# EAGLE design Sensirion_connector_board_v002 (EAGLE 9.6.2)
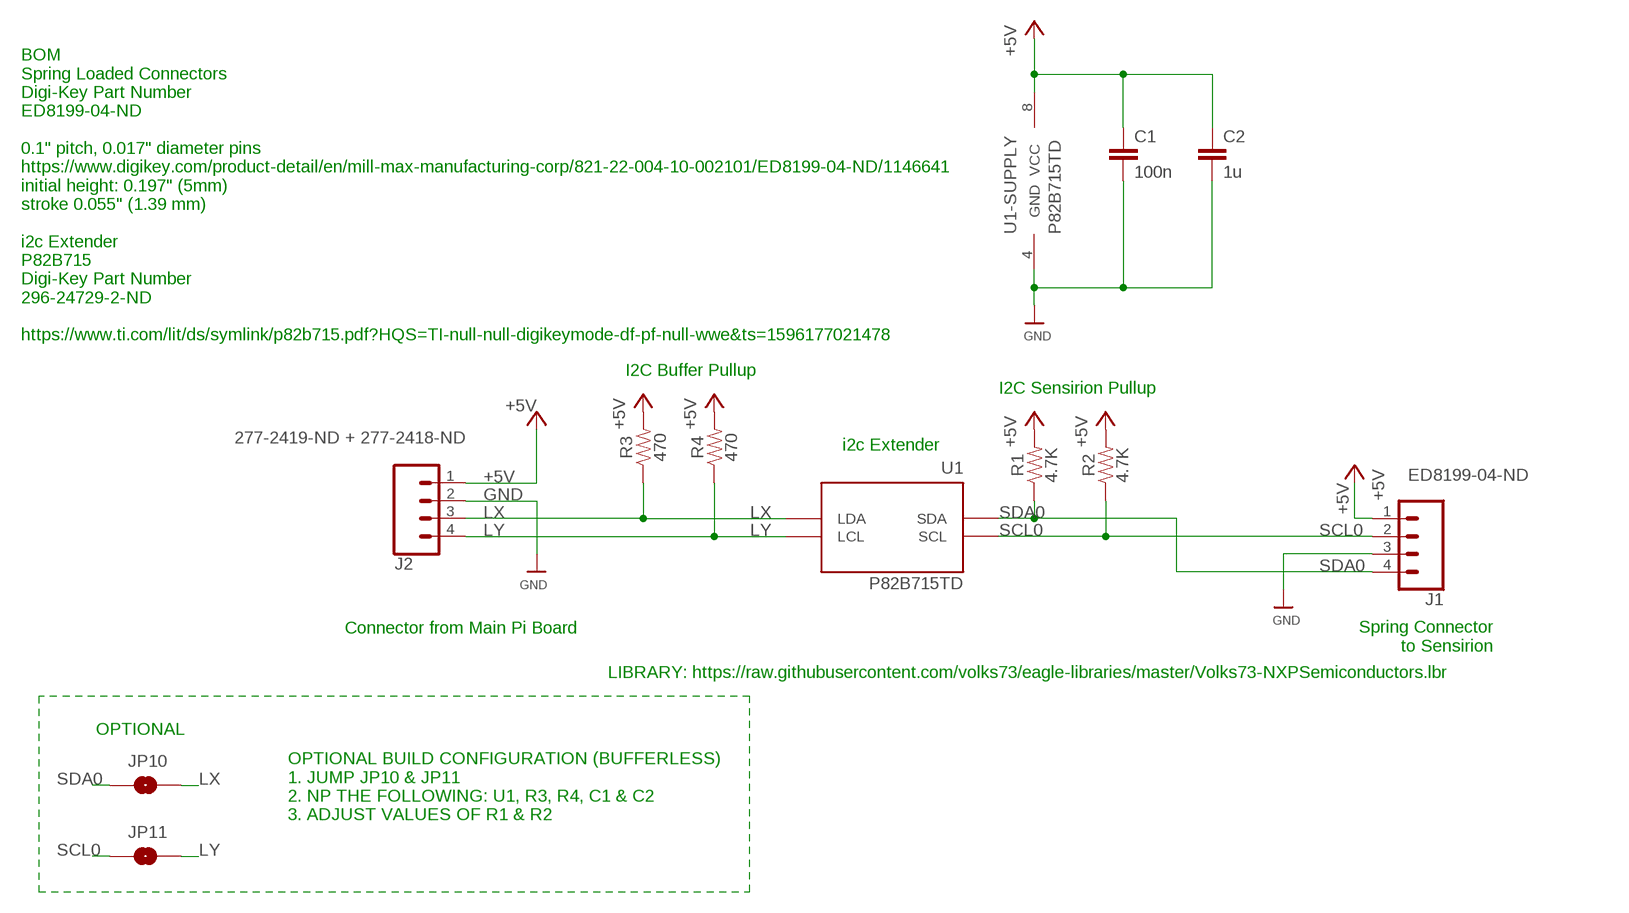
[diagram p0: schematic, sheet 1]

## Parts
C1  100n  CAP-0805  [0805]
C2  1u  CAP-0805  [0805]
J1  ED8199-04-ND  CONN_0430MILL_DIA  [1X04_30MILL_DIA]
J2  277-2419-ND + 277-2418-ND  CONN_043.5MM_RA  [1X04_3.5MM_RA]
JP10  JUMPER-SMT_2_NO_SILK  [SMT-JUMPER_2_NO_SILK]
JP11  JUMPER-SMT_2_NO_SILK  [SMT-JUMPER_2_NO_SILK]
R1  4.7K  0.3OHM-0805-1/8W-1%  [0805]
R2  4.7K  0.3OHM-0805-1/8W-1%  [0805]
R3  470  0.3OHM-0805-1/8W-1%  [0805]
R4  470  0.3OHM-0805-1/8W-1%  [0805]
U1  P82B715TD  [SOIC-8]

## Nets
+5V: C1.1 C2.1 J1.1 J2.1 R1.2 R2.2 R3.2 R4.2 U1.8(VCC)
GND: C1.2 C2.2 J1.3 J2.2 U1.4(GND)
LX: J2.3 JP10.2 R3.1 U1.7(LDA)
LY: J2.4 JP11.2 R4.1 U1.2(LCL)
SCL0: J1.2 JP11.1 R2.1 U1.3(SCL)
SDA0: J1.4 JP10.1 R1.1 U1.6(SDA)

## Notes on the sheet
- BOM
  Spring Loaded Connectors 
  Digi-Key Part Number
  ED8199-04-ND
  
  0.1" pitch, 0.017" diameter pins
  https://www.digikey.com/product-detail/en/mill-max-manufacturing-corp/821-22-004-10-002101/ED8199-04-ND/1146641
  initial height: 0.197" (5mm)
  stroke 0.055" (1.39 mm)
  
  i2c Extender
  P82B715 
  Digi-Key Part Number
  296-24729-2-ND
  
  https://www.ti.com/lit/ds/symlink/p82b715.pdf?HQS=TI-null-null-digikeymode-df-pf-null-wwe&ts=1596177021478
- I2C Buffer Pullup
- I2C Sensirion Pullup
- i2c Extender
- Connector from Main Pi Board
- Spring Connector
  to Sensirion
- LIBRARY: https://raw.githubusercontent.com/volks73/eagle-libraries/master/Volks73-NXPSemiconductors.lbr
- OPTIONAL
- OPTIONAL BUILD CONFIGURATION (BUFFERLESS)
  1. JUMP JP10 & JP11
  2. NP THE FOLLOWING: U1, R3, R4, C1 & C2
  3. ADJUST VALUES OF R1 & R2

## Library data of the parts
C1 C2 = SparkFun-Capacitors:CAP
J1 J2 = th_libraries:CONN_04: Multi connection point. Often used as Generic Header-pin footprint for 0.1 inch spaced/style header connections On any of the 0.1 inch spaced packages, you can populate with these: Break Away Headers - Straight <https://www.sparkfun.com/products/116> (PRT-00116) Break Away Male Headers - Right Angle <https://www.sparkfun.com/products/553> (PRT-00553) Female Headers <https://www.sparkfun.com/products/115> (PRT-00115) Break Away Headers - Machine Pin <https://www.sparkfun.com/products/117> (PRT-00117) Break Away Female Headers - Swiss Machine Pin <https://www.sparkfun.com/products/743> (PRT-00743) For SCREWTERMINALS and SPRING TERMINALS visit here: Screw Terimnals on SparkFun.com <https://www.sparkfun.com/search/results?term=Screw+Terminals> (5mm/3.5mm/2.54mm spacing) This device is also useful as a general connection point to wire up your design to another part of your project. Our various solder wires solder well into these plated through hole pads. Hook-Up Wire - Assortment (Stranded, 22 AWG) <https://www.sparkfun.com/products/11375> (PRT-11375) Hook-Up Wire - Assortment (Solid Core, 22 AWG) <https://www.sparkfun.com/products/11367> (PRT-11367) View the entire wire category on our website here <https://www.sparkfun.com/categories/141> Special notes: Molex polarized connector foot print use with SKU : PRT-08231 with associated crimp pins and housings. 1MM SMD Version SKU: PRT-10208
JP10 JP11 = SparkFun-Jumpers:JUMPER-SMT_2_NO: Normally open jumper This jumper has two pads in close proximity to each other. Apply solder to close the connection. Round pads are easier to solder for beginners, but are a lot larger. SparkFun Product that uses the round pads: SparkFun EL Sequencer <https://www.sparkfun.com/products/12781>
R1-R4 = SparkFun-Resistors:0.3OHM: 0.3Ω resistor A resistor is a passive two-terminal electrical component that implements electrical resistance as a circuit element. Resistors act to reduce current flow, and, at the same time, act to lower voltage levels within circuits. - Wikipedia; PROD_ID: RES-11622; VALUE: 0.3
U1 = Volks73-NXPSemiconductors:P82B715?: I2C-Bus Extender I2C-bus extender Documentation Datasheet <http://www.nxp.com/documents/data_sheet/P82B715.pdf> General Description The P82B715 is a bipolar IC intended for application in I2C-bus and derivative bus systems. While retaining all the operating modes and features of the I2C-bus it permits extension of the practical separation distance between components on the I2C-bus by buffering both the data (SDA) and the clock (SCL) lines. The I2C-bus capacitance limit of 400 pF restricts practical communication distances to a few meters. Using one P82B715 at each end of a long cable (connecting Lx/Ly to Lx/Ly) reduces that cable’s loading on the linked I2C-buses by a factor of 10 and allows the total system capacitance load (all devices, cable, connectors, and traces or wires connected to the I2C-bus) to be around 3000 pF while the loading on each I2C-bus on the Sx/Sy sides remains below 400 pF. Longer cables or low-cost, general-purpose wiring may be used to link I2C-bus based modules without degrading noise margins. Multiple P82B715s can be connected together, linking their Lx/Ly ports, in a star or multi-point architecture as long as the total capacitance of the system is less than about 3000 pF and each bus at an Sx/Sy connection is well below 400 pF. This configuration, with the master and/or slave devices attached to the Sx/Sy port of each P82B715, has full multi-master communication capability. The P82B715 alone does not support voltage level translation, but it can be simply implemented using low cost transistors when required. There is no restriction on interconnecting the Sx/Sy I/Os, and, because the device output levels are always held within 100 mV of input drive levels, P82B715 is compatible with bus buffers that use voltage level offsets, e.g., PCA9511A, PCA9517, Sx/Sy side of P82B96. The lower VOL level and ability to operate with any master, slave or bus buffer is the primary advantage of the using the P82B715 for long distance buses at the disadvantage of not isolating bus capacitance like the P82B96 or PCA9600 are able to do. The primary disadvantage of the P82B96 and PCA9600 is that the static level offset needed to isolate bus capacitance does not allow these devices to operate with other bus buffers with special offset levels or with master/slaves that require a VIL lower than 0.8 V with noise margin. A proven quick design-in point-to-point/multi-point circuit (Figure 9) is included in Section 8.2 to allow rapid use of the P82B715 along with comparison waveforms so that the designer can clearly see the trade-offs between the P82B715 and the P82B96/PCA9600 and choose the type of device that is best for their application. Features Dual, bidirectional, unity voltage gain buffer with no external directional control required Compatible with I2C-bus and its derivatives SMBus, PMBus, DDC, etc. Logic signal levels may include (but not exceed) both supply and ground Logic signal input voltage levels are output without change and are independent of VCC ×10 impedance transformation, but does not change logic voltage levels Supply voltage range 3 V to 12 V Clock speeds to at least 100 kHz and 400 kHz when other system delays permit ESD protection exceeds 2500 V HBM per Mil. Std 883C-3015.7 and 400 V MM per JESD22-A115 (I/Os have diodes to VCC and GND) Latch-up testing is done to JEDEC Standard JESD78 which exceeds 100 mA Applications Increase the total connected capacitance of an I2C-bus system to around 3000 pF Drive I2C-bus signals over long cables to approximately 50 meters or 3000 pF Drives ×10 lower impedance bus wiring for improved noise immunity Multi-drop distribution of I2C-bus signals using low cost twisted-pair cables AdvancedTCA radial IPMB architecture Driving 30 mA Fm+ devices from standard 3 mA parts; APPLICATIONS: I2C; CAPACITANCE-INPUT: 3000pF; CURRENT_SUPPLY: 22mA; DATA_RATE: 400kHz; DELAY_TIME: -; DESCRIPTION: IC REDRIVER I2C 1CH 400KHZ 8SO; DOCUMENTATION_LINK: <a href="http://www.nxp.com/documents/data_sheet/P82B715.pdf">Datasheet</a>; DOCUMENTATION_URL: http://www.nxp.com/documents/data_sheet/P82B715.pdf; INPUT: 2-Wire Buse; MANUFACTURER: NXP Semiconductors; NUMBER_OF_CHANNELS: 1; OPERATING_TEMPERATURE: -40C ~ 85C; OUTPUT: 2-Wire Bus; PART_NUMBER: P82B715TD,118; SIGNAL_CONDITIONING: -; SUPPLIER_ITEM_LINK: <a href="http://www.digikey.com/product-detail/en/P82B715TD,118/568-1007-2-ND/735621">Details</a>; SUPPLIER_ITEM_NUMBER: 568-1007-2-ND; SUPPLIER_ITEM_URL: http://www.digikey.com/product-detail/en/P82B715TD,118/568-1007-2-ND/735621; SUPPLIER_LINK: <a href="http://www.digikey.com">Home Page</a>; SUPPLIER_NAME: Digi-Key; SUPPLIER_URL: http://www.digikey.com; TYPE: Buffer, ReDriver; VOLTAGE_SUPPLY: 4.5V ~ 12V

## Board
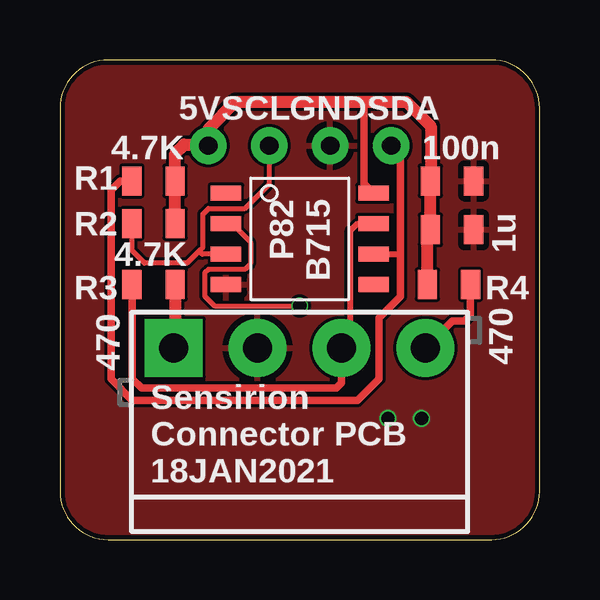
[diagram p1: board, top side]
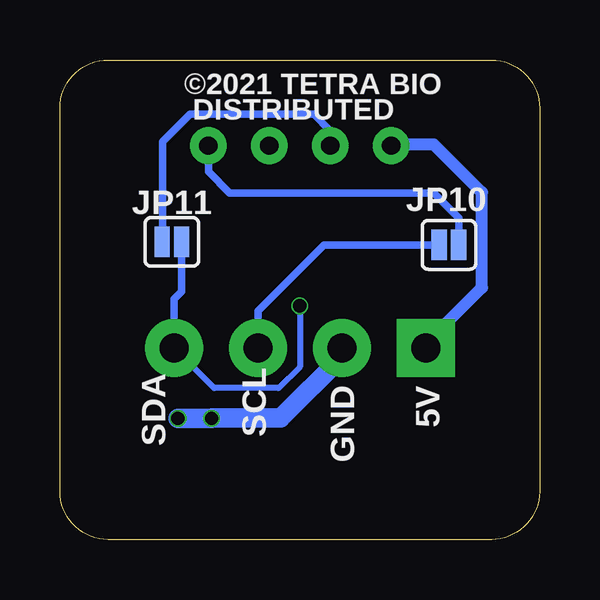
[diagram p2: board, bottom side, seen from below]

Size 20 x 20 mm. Coordinates in mm from the lower left corner, seen from the top.
Outline: 0,18 0,2 arc90 2,0 18,0 arc90 20,2 20,18 arc90 18,20 2,20 arc90 0,18
Copper layers (1*16): Top 0.035mm / dielectric 1.6mm / Bottom 0.035mm
Design rules "jlcpcb-2layers": minimum track width 5mil, minimum drill 0.3mm, track to track 5mil, track to pad 5mil, pad to pad 5mil, via to via 5mil, smd to smd 5mil, copper to edge 0.2mm, drill to drill 6mil, minimum pad ring 10mil, minimum via ring 3mil, stop-mask expansion 4mil, vias tented up to drill 0mil, thermal gap 10mil

### Footprints (pad centres in the part's own frame; a part is rotated, then mirrored left to right if it is on the bottom)
0805 = smd 0.8 x 1.2: 1 -0.9,0; 2 0.9,0
1X04_30MILL_DIA = drill 0.762 pad 1.524: 1 0,0; 2 2.54,0; 3 5.08,0; 4 7.62,0
1X04_3.5MM_RA = drill 1.2 pad 2.413 square: 1 -0.228,0.023 | drill 1.2 pad 2.413: 2 3.272,0.023; 3 6.772,0.023; 4 10.272,0.023
SMT-JUMPER_2_NO_SILK = smd 0.635 x 1.27: 1 -0.406,0; 2 0.406,0
SOIC-8 = smd 1.27 x 0.635: 1 -3.073,1.905; 2 -3.073,0.635; 3 -3.073,-0.635; 4 -3.073,-1.905; 5 3.073,-1.905; 6 3.073,-0.635; 7 3.073,0.635; 8 3.073,1.905

### Placement (x,y rotation side)
C1  16.35,14.95 0 top
C2  16.35,12.92 0 top
J1  6.19,16.43 0 top
J2  4.97,7.97 0 top
JP10  3.78,12.29 180 bottom
JP11  15.33,12.41 0 bottom
R1  3.9,14.95 0 top
R2  3.9,13.17 0 top
R3  3.9,10.63 0 top
R4  16.22,10.63 180 top
U1  10,12.54 0 top

### Tracks (layer width: path | path; a pad name or v marks a point on that pad's centre or on a via)
+5V
  Top 0.305: U1.8 12.67,14.85 12.67,18.25
  Top 0.508: R4.2 15.32,12.79 C2.1 C1.1 15.46,14.96 15.46,17.24 14.45,18.25 12.67,18.25 7.33,18.25 6.19,17.11 J1.1 6.14,16.48 5.17,16.48 4.8,16.11 R1.2 R2.2 | R3.2 4.8,8.05 J2.1
  Bottom 0.508: J2.1 4.74,8.17 2.41,10.51 2.41,14.47 4.41,16.48 6.14,16.48 J1.1
GND  (via drill 0.55)
  Bottom 0.813: v15.08,5.05 v13.68,5.05 13.66,5.06 10.8,5.06 8.24,7.62 J2.2
  pour Top: -0.16,20.16 20.16,20.16 20.16,-0.16 -0.16,-0.16
LX
  Top 0.254: J2.3 12.12,8.37 12.12,12.89 12.41,13.17 U1.7
  Top 0.305: J2.3 11.74,6.54 11.52,6.32 3.4,6.32 3.02,6.7 3.02,10.62 R3.1
  Bottom 0.305: JP10.2 8.98,12.29 11.74,9.53 J2.3
LY  (via drill 0.55)
  Top 0.203: U1.2 7.18,13.17 7.94,12.41 7.94,11.5 7.71,11.27 6.19,11.27 6.04,11.12 6.04,10.15 6.44,9.75 v10,9.75
  Top 0.305: J2.4 16.36,9.11 16.86,9.11 17.11,9.37 17.11,10.62 R4.1
  Bottom 0.254: v10,9.75 10,7.21 10.89,6.32 13.57,6.32 J2.4
  Bottom 0.305: JP11.2 14.93,10.34 15.24,10.02 J2.4
SCL0
  Top 0.203: J1.2 8.73,14.83 7.71,13.81 6.19,13.81 5.96,13.58 5.96,12.18 5.81,12.03 | R2.1 3,12.04 3.52,11.52 5.3,11.52 5.81,12.03 | U1.3 5.94,11.9 5.81,12.03
  Bottom 0.305: J1.2 8.73,17.06 9.42,17.75 14.57,17.75 15.71,16.6 15.71,12.44 JP11.1
SDA0
  Top 0.254: U1.6 14.19,11.9
  Top 0.305: J1.4 14.19,16.05 14.19,11.9 14.19,10.13 13.3,9.24 13.3,6.7 12.41,5.81 3.02,5.81 2.13,6.7 2.13,14.57 2.51,14.95 R1.1
  Bottom 0.305: JP10.1 3.37,13.4 4.41,14.45 12.92,14.45 13.81,15.33 J1.4

### Text on the board
tPlace: 5V | SCL | GND | SDA | P82 / B715 | Sensirion / Connector PCB / 18JAN2021
bPlace: ©2021 TETRA BIO / DISTRIBUTED | GND | 5V | SCL | SDA